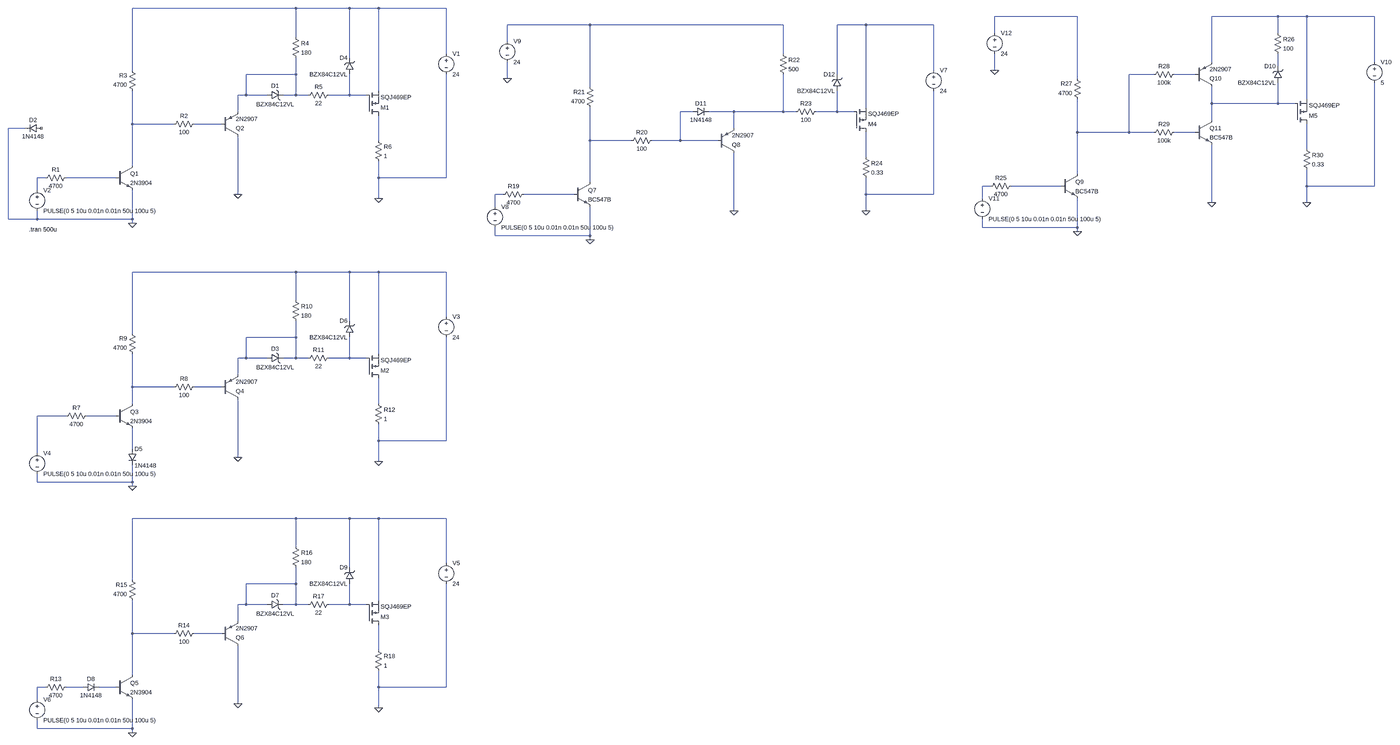
[diagram p0: schematic DriverMos.asc, whole sheet]
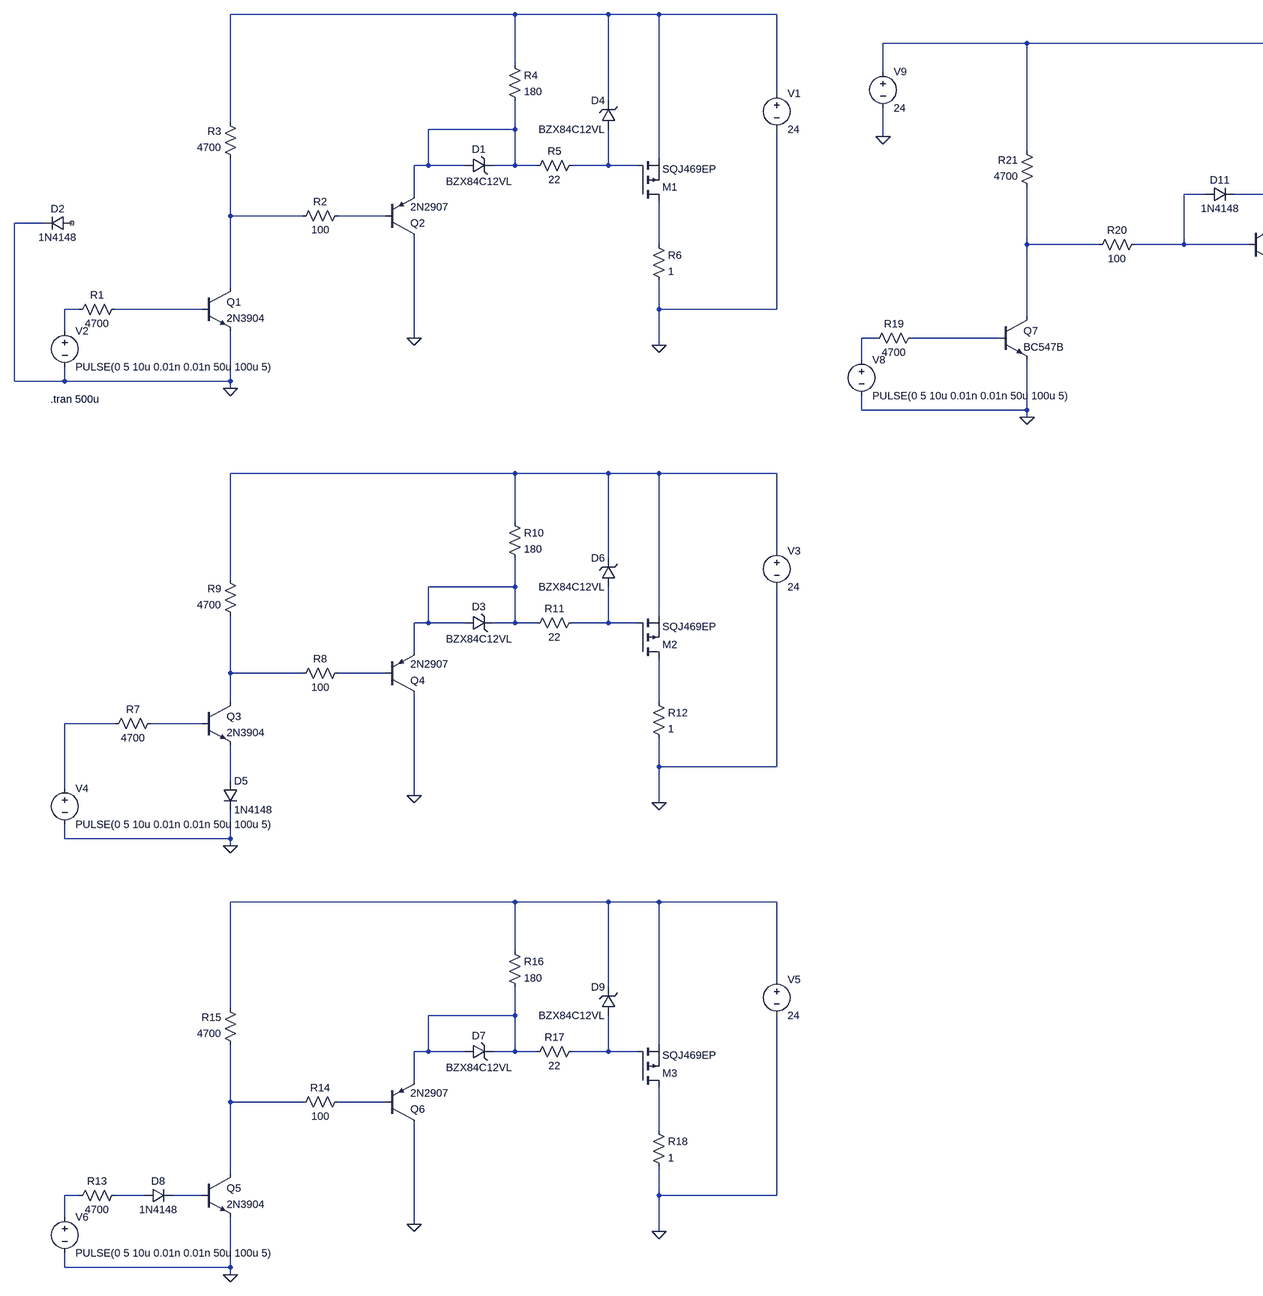
[diagram p1: schematic DriverMos.asc, part, row 1 of 1, column 1 of 2]
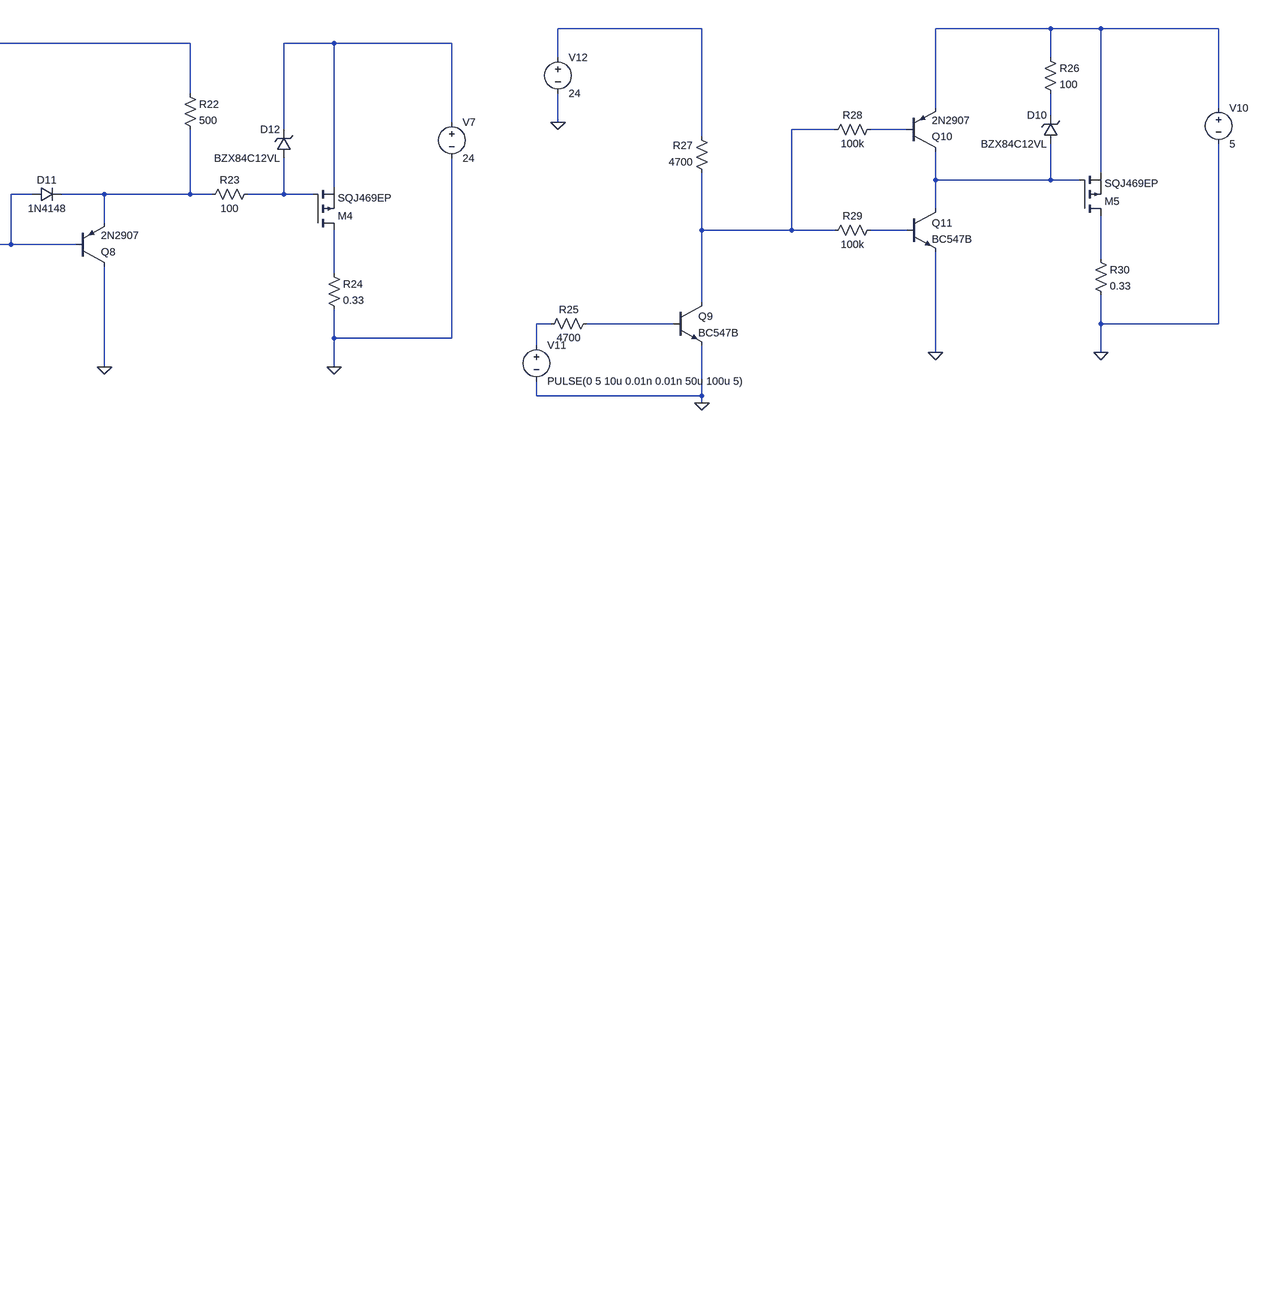
[diagram p2: schematic DriverMos.asc, part, row 1 of 1, column 2 of 2]
DriverMos.asc, the LTspice schematic file:
Version 4
SHEET 1 6856 2392
WIRE 912 -496 128 -496
WIRE 1120 -496 912 -496
WIRE 1232 -496 1120 -496
WIRE 1552 -496 1232 -496
WIRE 5360 -464 5040 -464
WIRE 6352 -464 6096 -464
WIRE 6464 -464 6352 -464
WIRE 6784 -464 6464 -464
WIRE 2400 -432 2080 -432
WIRE 3184 -432 2400 -432
WIRE 3504 -432 3392 -432
WIRE 3824 -432 3504 -432
WIRE 5040 -400 5040 -464
WIRE 6352 -400 6352 -464
WIRE 912 -384 912 -496
WIRE 2080 -368 2080 -432
WIRE 1552 -320 1552 -496
WIRE 3184 -320 3184 -432
WIRE 1120 -304 1120 -496
WIRE 6096 -288 6096 -464
WIRE 6784 -288 6784 -464
WIRE 6352 -272 6352 -320
WIRE 128 -256 128 -496
WIRE 3824 -256 3824 -432
WIRE 5040 -256 5040 -320
WIRE 912 -240 912 -304
WIRE 912 -240 720 -240
WIRE 3392 -240 3392 -432
WIRE 5872 -240 5776 -240
WIRE 6032 -240 5952 -240
WIRE 2080 -224 2080 -288
WIRE 5360 -224 5360 -464
WIRE 2400 -192 2400 -432
WIRE 1232 -176 1232 -496
WIRE 720 -160 720 -240
WIRE 720 -160 688 -160
WIRE 800 -160 720 -160
WIRE 912 -160 912 -240
WIRE 912 -160 864 -160
WIRE 960 -160 912 -160
WIRE 1120 -160 1120 -240
WIRE 1120 -160 1040 -160
WIRE 1184 -160 1120 -160
WIRE 6464 -144 6464 -464
WIRE 6096 -128 6096 -192
WIRE 6352 -128 6352 -208
WIRE 6352 -128 6096 -128
WIRE 6416 -128 6352 -128
WIRE 3504 -112 3504 -432
WIRE 688 -96 688 -160
WIRE 2800 -96 2752 -96
WIRE 2960 -96 2864 -96
WIRE 3184 -96 3184 -240
WIRE 3184 -96 2960 -96
WIRE 3232 -96 3184 -96
WIRE 3392 -96 3392 -176
WIRE 3392 -96 3312 -96
WIRE 3456 -96 3392 -96
WIRE 6096 -64 6096 -128
WIRE 128 -48 128 -176
WIRE 288 -48 128 -48
WIRE 624 -48 368 -48
WIRE -288 -32 -352 -32
WIRE 2960 -32 2960 -96
WIRE 5360 -16 5360 -144
WIRE 5776 -16 5776 -240
WIRE 5776 -16 5360 -16
WIRE 5872 -16 5776 -16
WIRE 6032 -16 5952 -16
WIRE 1232 16 1232 -80
WIRE 2400 16 2400 -112
WIRE 2560 16 2400 16
WIRE 2752 16 2752 -96
WIRE 2752 16 2640 16
WIRE 2896 16 2752 16
WIRE 6464 48 6464 -48
WIRE 3504 80 3504 -16
WIRE 128 112 128 -48
WIRE 5360 144 5360 -16
WIRE -208 160 -240 160
WIRE 64 160 -128 160
WIRE 1232 160 1232 96
WIRE 1552 160 1552 -240
WIRE 1552 160 1232 160
WIRE 2400 176 2400 16
WIRE 5024 192 4992 192
WIRE 5296 192 5104 192
WIRE 6464 192 6464 128
WIRE 6784 192 6784 -208
WIRE 6784 192 6464 192
WIRE -240 208 -240 160
WIRE 688 224 688 0
WIRE 2064 224 2032 224
WIRE 2336 224 2144 224
WIRE 3504 224 3504 160
WIRE 3824 224 3824 -176
WIRE 3824 224 3504 224
WIRE 1232 240 1232 160
WIRE 4992 240 4992 192
WIRE 6096 256 6096 32
WIRE 6464 256 6464 192
WIRE 2032 272 2032 224
WIRE 2960 288 2960 64
WIRE 3504 288 3504 224
WIRE -352 320 -352 -32
WIRE -240 320 -240 288
WIRE -240 320 -352 320
WIRE 128 320 128 208
WIRE 128 320 -240 320
WIRE 128 336 128 320
WIRE 4992 352 4992 320
WIRE 5360 352 5360 240
WIRE 5360 352 4992 352
WIRE 5360 368 5360 352
WIRE 2032 384 2032 352
WIRE 2400 384 2400 272
WIRE 2400 384 2032 384
WIRE 2400 400 2400 384
WIRE 912 528 128 528
WIRE 1120 528 912 528
WIRE 1232 528 1120 528
WIRE 1552 528 1232 528
WIRE 912 640 912 528
WIRE 1552 704 1552 528
WIRE 1120 720 1120 528
WIRE 128 768 128 528
WIRE 912 784 912 720
WIRE 912 784 720 784
WIRE 1232 848 1232 528
WIRE 720 864 720 784
WIRE 720 864 688 864
WIRE 800 864 720 864
WIRE 912 864 912 784
WIRE 912 864 864 864
WIRE 960 864 912 864
WIRE 1120 864 1120 784
WIRE 1120 864 1040 864
WIRE 1184 864 1120 864
WIRE 688 928 688 864
WIRE 128 976 128 848
WIRE 288 976 128 976
WIRE 624 976 368 976
WIRE 128 1040 128 976
WIRE 1232 1040 1232 944
WIRE -128 1088 -240 1088
WIRE 64 1088 -48 1088
WIRE 1232 1184 1232 1120
WIRE 1552 1184 1552 784
WIRE 1552 1184 1232 1184
WIRE 128 1216 128 1136
WIRE -240 1232 -240 1088
WIRE 688 1248 688 1024
WIRE 1232 1264 1232 1184
WIRE -240 1344 -240 1312
WIRE 128 1344 128 1280
WIRE 128 1344 -240 1344
WIRE 128 1360 128 1344
WIRE 912 1520 128 1520
WIRE 1120 1520 912 1520
WIRE 1232 1520 1120 1520
WIRE 1552 1520 1232 1520
WIRE 912 1632 912 1520
WIRE 1552 1696 1552 1520
WIRE 1120 1712 1120 1520
WIRE 128 1760 128 1520
WIRE 912 1776 912 1712
WIRE 912 1776 720 1776
WIRE 1232 1840 1232 1520
WIRE 720 1856 720 1776
WIRE 720 1856 688 1856
WIRE 800 1856 720 1856
WIRE 912 1856 912 1776
WIRE 912 1856 864 1856
WIRE 960 1856 912 1856
WIRE 1120 1856 1120 1776
WIRE 1120 1856 1040 1856
WIRE 1184 1856 1120 1856
WIRE 688 1920 688 1856
WIRE 128 1968 128 1840
WIRE 288 1968 128 1968
WIRE 624 1968 368 1968
WIRE 1232 2032 1232 1936
WIRE 128 2128 128 1968
WIRE -208 2176 -240 2176
WIRE -64 2176 -128 2176
WIRE 64 2176 0 2176
WIRE 1232 2176 1232 2112
WIRE 1552 2176 1552 1776
WIRE 1552 2176 1232 2176
WIRE -240 2224 -240 2176
WIRE 688 2240 688 2016
WIRE 1232 2256 1232 2176
WIRE -240 2336 -240 2304
WIRE 128 2336 128 2224
WIRE 128 2336 -240 2336
WIRE 128 2352 128 2336
FLAG 1232 240 0
FLAG 688 224 0
FLAG 128 336 0
FLAG 1232 1264 0
FLAG 688 1248 0
FLAG 128 1360 0
FLAG 1232 2256 0
FLAG 688 2240 0
FLAG 128 2352 0
FLAG 3504 288 0
FLAG 2960 288 0
FLAG 2400 400 0
FLAG 2080 -224 0
FLAG 6464 256 0
FLAG 5360 368 0
FLAG 5040 -256 0
FLAG 6096 256 0
SYMBOL npn 64 112 R0
SYMATTR InstName Q1
SYMATTR Value 2N3904
SYMBOL pnp 624 0 M180
SYMATTR InstName Q2
SYMATTR Value 2N2907
SYMBOL res -112 144 R90
WINDOW 0 0 56 VBottom 2
WINDOW 3 32 56 VTop 2
SYMATTR InstName R1
SYMATTR Value 4700
SYMBOL res 384 -64 R90
WINDOW 0 0 56 VBottom 2
WINDOW 3 32 56 VTop 2
SYMATTR InstName R2
SYMATTR Value 100
SYMBOL res 144 -160 R180
WINDOW 0 36 76 Left 2
WINDOW 3 36 40 Left 2
SYMATTR InstName R3
SYMATTR Value 4700
SYMBOL res 896 -400 R0
SYMATTR InstName R4
SYMATTR Value 180
SYMBOL res 1056 -176 R90
WINDOW 0 0 56 VBottom 2
WINDOW 3 32 56 VTop 2
SYMATTR InstName R5
SYMATTR Value 22
SYMBOL pmos 1184 -80 M180
SYMATTR InstName M1
SYMATTR Value SQJ469EP
SYMBOL zener 800 -144 R270
WINDOW 0 36 32 VTop 2
WINDOW 3 -4 32 VBottom 2
SYMATTR InstName D1
SYMATTR Value BZX84C12VL
SYMBOL res 1216 0 R0
SYMATTR InstName R6
SYMATTR Value 1
SYMBOL voltage 1552 -336 R0
WINDOW 123 0 0 Left 0
WINDOW 39 0 0 Left 0
SYMATTR InstName V1
SYMATTR Value 24
SYMBOL voltage -240 192 R0
WINDOW 123 0 0 Left 0
WINDOW 39 0 0 Left 0
SYMATTR InstName V2
SYMATTR Value PULSE(0 5 10u 0.01n 0.01n 50u 100u 5)
SYMBOL diode -224 -48 R90
WINDOW 0 0 32 VBottom 2
WINDOW 3 32 32 VTop 2
SYMATTR InstName D2
SYMATTR Value 1N4148
SYMBOL zener 1136 -240 R180
WINDOW 0 24 64 Left 2
WINDOW 3 24 0 Left 2
SYMATTR InstName D4
SYMATTR Value BZX84C12VL
SYMBOL npn 64 1040 R0
SYMATTR InstName Q3
SYMATTR Value 2N3904
SYMBOL pnp 624 1024 M180
SYMATTR InstName Q4
SYMATTR Value 2N2907
SYMBOL res -32 1072 R90
WINDOW 0 0 56 VBottom 2
WINDOW 3 32 56 VTop 2
SYMATTR InstName R7
SYMATTR Value 4700
SYMBOL res 384 960 R90
WINDOW 0 0 56 VBottom 2
WINDOW 3 32 56 VTop 2
SYMATTR InstName R8
SYMATTR Value 100
SYMBOL res 144 864 R180
WINDOW 0 36 76 Left 2
WINDOW 3 36 40 Left 2
SYMATTR InstName R9
SYMATTR Value 4700
SYMBOL res 896 624 R0
SYMATTR InstName R10
SYMATTR Value 180
SYMBOL res 1056 848 R90
WINDOW 0 0 56 VBottom 2
WINDOW 3 32 56 VTop 2
SYMATTR InstName R11
SYMATTR Value 22
SYMBOL pmos 1184 944 M180
SYMATTR InstName M2
SYMATTR Value SQJ469EP
SYMBOL zener 800 880 R270
WINDOW 0 36 32 VTop 2
WINDOW 3 -4 32 VBottom 2
SYMATTR InstName D3
SYMATTR Value BZX84C12VL
SYMBOL res 1216 1024 R0
SYMATTR InstName R12
SYMATTR Value 1
SYMBOL voltage 1552 688 R0
WINDOW 123 0 0 Left 0
WINDOW 39 0 0 Left 0
SYMATTR InstName V3
SYMATTR Value 24
SYMBOL voltage -240 1216 R0
WINDOW 123 0 0 Left 0
WINDOW 39 0 0 Left 0
SYMATTR InstName V4
SYMATTR Value PULSE(0 5 10u 0.01n 0.01n 50u 100u 5)
SYMBOL diode 112 1216 R0
SYMATTR InstName D5
SYMATTR Value 1N4148
SYMBOL zener 1136 784 R180
WINDOW 0 24 64 Left 2
WINDOW 3 24 0 Left 2
SYMATTR InstName D6
SYMATTR Value BZX84C12VL
SYMBOL npn 64 2128 R0
SYMATTR InstName Q5
SYMATTR Value 2N3904
SYMBOL pnp 624 2016 M180
SYMATTR InstName Q6
SYMATTR Value 2N2907
SYMBOL res -112 2160 R90
WINDOW 0 0 56 VBottom 2
WINDOW 3 32 56 VTop 2
SYMATTR InstName R13
SYMATTR Value 4700
SYMBOL res 384 1952 R90
WINDOW 0 0 56 VBottom 2
WINDOW 3 32 56 VTop 2
SYMATTR InstName R14
SYMATTR Value 100
SYMBOL res 144 1856 R180
WINDOW 0 36 76 Left 2
WINDOW 3 36 40 Left 2
SYMATTR InstName R15
SYMATTR Value 4700
SYMBOL res 896 1616 R0
SYMATTR InstName R16
SYMATTR Value 180
SYMBOL res 1056 1840 R90
WINDOW 0 0 56 VBottom 2
WINDOW 3 32 56 VTop 2
SYMATTR InstName R17
SYMATTR Value 22
SYMBOL pmos 1184 1936 M180
SYMATTR InstName M3
SYMATTR Value SQJ469EP
SYMBOL zener 800 1872 R270
WINDOW 0 36 32 VTop 2
WINDOW 3 -4 32 VBottom 2
SYMATTR InstName D7
SYMATTR Value BZX84C12VL
SYMBOL res 1216 2016 R0
SYMATTR InstName R18
SYMATTR Value 1
SYMBOL voltage 1552 1680 R0
WINDOW 123 0 0 Left 0
WINDOW 39 0 0 Left 0
SYMATTR InstName V5
SYMATTR Value 24
SYMBOL voltage -240 2208 R0
WINDOW 123 0 0 Left 0
WINDOW 39 0 0 Left 0
SYMATTR InstName V6
SYMATTR Value PULSE(0 5 10u 0.01n 0.01n 50u 100u 5)
SYMBOL diode -64 2192 R270
WINDOW 0 32 32 VTop 2
WINDOW 3 0 32 VBottom 2
SYMATTR InstName D8
SYMATTR Value 1N4148
SYMBOL zener 1136 1776 R180
WINDOW 0 24 64 Left 2
WINDOW 3 24 0 Left 2
SYMATTR InstName D9
SYMATTR Value BZX84C12VL
SYMBOL npn 2336 176 R0
SYMATTR InstName Q7
SYMATTR Value BC547B
SYMBOL pnp 2896 64 M180
SYMATTR InstName Q8
SYMATTR Value 2N2907
SYMBOL res 2160 208 R90
WINDOW 0 0 56 VBottom 2
WINDOW 3 32 56 VTop 2
SYMATTR InstName R19
SYMATTR Value 4700
SYMBOL res 2656 0 R90
WINDOW 0 0 56 VBottom 2
WINDOW 3 32 56 VTop 2
SYMATTR InstName R20
SYMATTR Value 100
SYMBOL res 2416 -96 R180
WINDOW 0 36 76 Left 2
WINDOW 3 36 40 Left 2
SYMATTR InstName R21
SYMATTR Value 4700
SYMBOL res 3168 -336 R0
SYMATTR InstName R22
SYMATTR Value 500
SYMBOL res 3328 -112 R90
WINDOW 0 0 56 VBottom 2
WINDOW 3 32 56 VTop 2
SYMATTR InstName R23
SYMATTR Value 100
SYMBOL pmos 3456 -16 M180
SYMATTR InstName M4
SYMATTR Value SQJ469EP
SYMBOL res 3488 64 R0
SYMATTR InstName R24
SYMATTR Value 0.33
SYMBOL voltage 3824 -272 R0
WINDOW 123 0 0 Left 0
WINDOW 39 0 0 Left 0
SYMATTR InstName V7
SYMATTR Value 24
SYMBOL voltage 2032 256 R0
WINDOW 123 0 0 Left 0
WINDOW 39 0 0 Left 0
SYMATTR InstName V8
SYMATTR Value PULSE(0 5 10u 0.01n 0.01n 50u 100u 5)
SYMBOL zener 3408 -176 R180
WINDOW 0 24 64 Left 2
WINDOW 3 24 0 Left 2
SYMATTR InstName D12
SYMATTR Value BZX84C12VL
SYMBOL diode 2800 -80 R270
WINDOW 0 32 32 VTop 2
WINDOW 3 0 32 VBottom 2
SYMATTR InstName D11
SYMATTR Value 1N4148
SYMBOL voltage 2080 -384 R0
WINDOW 123 0 0 Left 0
WINDOW 39 0 0 Left 0
SYMATTR InstName V9
SYMATTR Value 24
SYMBOL npn 5296 144 R0
SYMATTR InstName Q9
SYMATTR Value BC547B
SYMBOL pnp 6032 -192 M180
SYMATTR InstName Q10
SYMATTR Value 2N2907
SYMBOL res 5120 176 R90
WINDOW 0 0 56 VBottom 2
WINDOW 3 32 56 VTop 2
SYMATTR InstName R25
SYMATTR Value 4700
SYMBOL res 5376 -128 R180
WINDOW 0 36 76 Left 2
WINDOW 3 36 40 Left 2
SYMATTR InstName R27
SYMATTR Value 4700
SYMBOL pmos 6416 -48 M180
SYMATTR InstName M5
SYMATTR Value SQJ469EP
SYMBOL res 6448 32 R0
SYMATTR InstName R30
SYMATTR Value 0.33
SYMBOL voltage 6784 -304 R0
WINDOW 123 0 0 Left 0
WINDOW 39 0 0 Left 0
SYMATTR InstName V10
SYMATTR Value 5
SYMBOL voltage 4992 224 R0
WINDOW 123 0 0 Left 0
WINDOW 39 0 0 Left 0
SYMATTR InstName V11
SYMATTR Value PULSE(0 5 10u 0.01n 0.01n 50u 100u 5)
SYMBOL zener 6368 -208 R180
WINDOW 0 24 64 Left 2
WINDOW 3 24 0 Left 2
SYMATTR InstName D10
SYMATTR Value BZX84C12VL
SYMBOL voltage 5040 -416 R0
WINDOW 123 0 0 Left 0
WINDOW 39 0 0 Left 0
SYMATTR InstName V12
SYMATTR Value 24
SYMBOL npn 6032 -64 R0
SYMATTR InstName Q11
SYMATTR Value BC547B
SYMBOL res 5968 -256 R90
WINDOW 0 0 56 VBottom 2
WINDOW 3 32 56 VTop 2
SYMATTR InstName R28
SYMATTR Value 100k
SYMBOL res 5968 -32 R90
WINDOW 0 0 56 VBottom 2
WINDOW 3 32 56 VTop 2
SYMATTR InstName R29
SYMATTR Value 100k
SYMBOL res 6336 -416 R0
SYMATTR InstName R26
SYMATTR Value 100
TEXT -272 360 Left 2 !.tran 500u

The netlist it stands for:
* DriverMos.asc
Q1 N015 N023 0 0 2N3904
Q2 0 N016 N007 0 2N2907
R1 N023 N022 4700
R2 N016 N015 100
R3 N015 N001 4700
R4 N001 N007 180
R5 N010 N007 22
M1 N018 N010 N001 N001 SQJ469EP
D1 N007 N007 BZX84C12VL
R6 N018 0 1
V1 N001 0 24
V2 N022 0 PULSE(0 5 10u 0.01n 0.01n 50u 100u 5)
D2 NC_01 0 1N4148
D4 N010 N001 BZX84C12VL
Q3 N031 N035 N036 0 2N3904
Q4 0 N032 N029 0 2N2907
R7 N035 N034 4700
R8 N032 N031 100
R9 N031 N028 4700
R10 N028 N029 180
R11 N030 N029 22
M2 N033 N030 N028 N028 SQJ469EP
D3 N029 N029 BZX84C12VL
R12 N033 0 1
V3 N028 0 24
V4 N034 0 PULSE(0 5 10u 0.01n 0.01n 50u 100u 5)
D5 N036 0 1N4148
D6 N030 N028 BZX84C12VL
Q5 N040 N045 0 0 2N3904
Q6 0 N041 N038 0 2N2907
R13 N044 N043 4700
R14 N041 N040 100
R15 N040 N037 4700
R16 N037 N038 180
R17 N039 N038 22
M3 N042 N039 N037 N037 SQJ469EP
D7 N038 N038 BZX84C12VL
R18 N042 0 1
V5 N037 0 24
V6 N043 0 PULSE(0 5 10u 0.01n 0.01n 50u 100u 5)
D8 N044 N045 1N4148
D9 N039 N037 BZX84C12VL
Q7 N019 N027 0 0 BC547B
Q8 0 N012 N013 0 2N2907
R19 N027 N026 4700
R20 N012 N019 100
R21 N019 N004 4700
R22 N004 N013 500
R23 N014 N013 100
M4 N021 N014 N005 N005 SQJ469EP
R24 N021 0 0.33
V7 N005 0 24
V8 N026 0 PULSE(0 5 10u 0.01n 0.01n 50u 100u 5)
D12 N014 N005 BZX84C12VL
D11 N012 N013 1N4148
V9 N004 0 24
Q9 N008 N025 0 0 BC547B
Q10 N011 N009 N003 0 2N2907
R25 N025 N024 4700
R27 N008 N002 4700
M5 N020 N011 N003 N003 SQJ469EP
R30 N020 0 0.33
V10 N003 0 5
V11 N024 0 PULSE(0 5 10u 0.01n 0.01n 50u 100u 5)
D10 N011 N006 BZX84C12VL
V12 N002 0 24
Q11 N011 N017 0 0 BC547B
R28 N009 N008 100k
R29 N017 N008 100k
R26 N003 N006 100
.model D D
.lib standard.dio
.model NPN NPN
.model PNP PNP
.lib standard.bjt
.model NMOS NMOS
.model PMOS PMOS
.lib standard.mos
.tran 500u
.backanno
.end